# Altium schematic sheet DIRECTORY.SchDoc
size A4; SheetNumber: 1; SheetTotal: 6
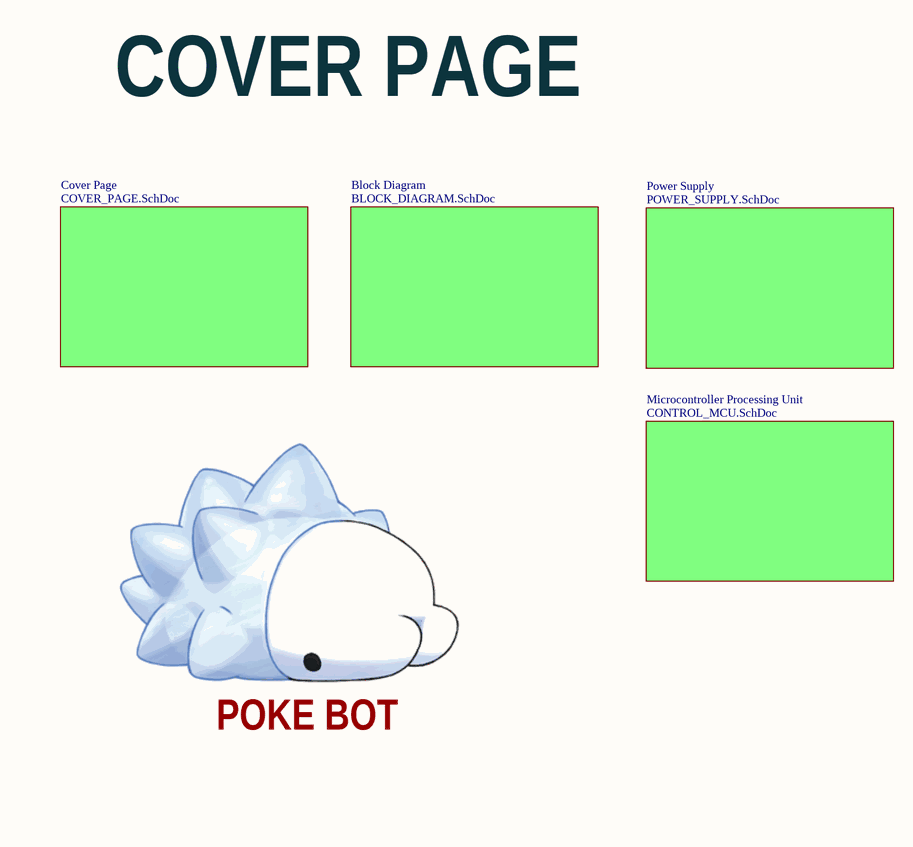
[diagram p0: DIRECTORY.SchDoc]

## Sub-sheets
Block Diagram = BLOCK_DIAGRAM.SchDoc: no entries
Cover Page = COVER_PAGE.SchDoc: no entries
Microcontroller Processing Unit = CONTROL_MCU.SchDoc: no entries
Power Supply = POWER_SUPPLY.SchDoc: no entries

## Notes on the sheet
- COVER PAGE
- POKE BOT
- Documento:
- Autor:
- Carnet:
- Proyecto:
- Curso:
- Fecha:
- Revisión:
- Tamaño:
- Carta
- Hoja:
- de: